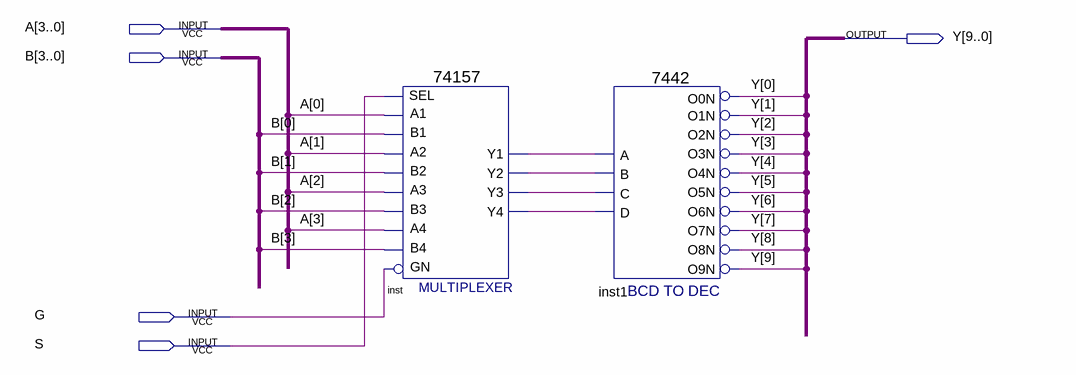
[diagram p0: schematic sheet]
// Quartus schematic L0501.bdf as structural Verilog: 2 symbols, 5 pins
module L0501 (
  input  [3:0] A,
  input  [3:0] B,
  input  G,
  input  S,
  output [9:0] Y
);

  wire inst_y1, inst_y2, inst_y3, inst_y4;

  \74157  inst (
    .A1(A[0]), .B1(B[0]), .SEL(S), .B2(B[1]), .A3(A[2]), .B3(B[2]), .A2(A[1]), .B4(B[3]), .GN(G), .A4(A[3]),
    .Y2(inst_y2), .Y1(inst_y1), .Y4(inst_y4), .Y3(inst_y3));
  \7442  inst1 (
    .D(inst_y4), .B(inst_y2), .C(inst_y3), .A(inst_y1), .O7N(Y[7]), .O8N(Y[8]), .O9N(Y[9]), .O0N(Y[0]),
    .O3N(Y[3]), .O2N(Y[2]), .O1N(Y[1]), .O6N(Y[6]), .O5N(Y[5]), .O4N(Y[4]));
endmodule
